# Altium schematic sheet egress.SchDoc: Power Egress
size Letter; CompanyName: Signal Laboratories, Inc.; DrawnBy: J. Brinton; Engineer: J. Brinton; Address1: 3479 Edison Way; Address2: Menlo Park CA 94025; Address3: +1 (877) 778-8435; Address4: siglabs.com; Revision: 1; SheetNumber: 6; SheetTotal: 7
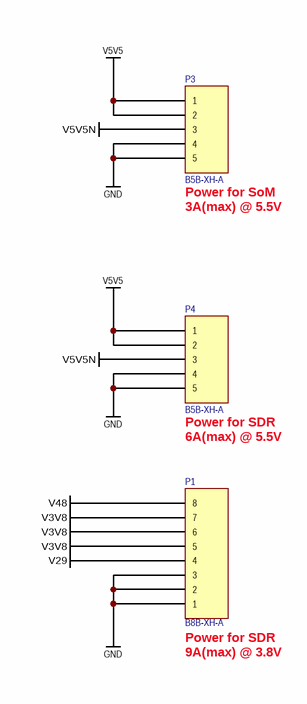
[diagram p0: egress.SchDoc]

## Parts
P1  B8B-XH-A  [B8B-XH-A]
P3  B5B-XH-A  [B5B-XH-A]
P4  B5B-XH-A  [B5B-XH-A]

## Nets
GND: P1.1 P1.2 P1.3 P3.4 P3.5 P4.4 P4.5
V3V8: P1.5 P1.6 P1.7
V5V5: P3.1 P3.2 P4.1 P4.2
V5V5N: P3.3 P4.3
V29: P1.4
V48: P1.8

## Notes on the sheet
- (near P3) Power for SoM
- (near P3) 3A(max) @ 5.5V
- (near P4) Power for SDR
- 6A(max) @ 5.5V
- (near P1) Power for SDR
- (near P1) 9A(max) @ 3.8V
- Title
- Engineer
- Revision
- Drawn By
- Checked By
- Date
- Sheet
- of

## Library data of the parts
P1 = S8B-XH-A: 2.5mm pitch 8-position connector; Manufacturer: JST; Manufacturer P/N: B8B-XH-A
P3 P4 = S5B-XH-A: 2.5mm pitch 5-position connector; Manufacturer: JST; Manufacturer P/N: B5B-XH-A